# EAGLE design Balancing v1 (EAGLE 9.6.2)
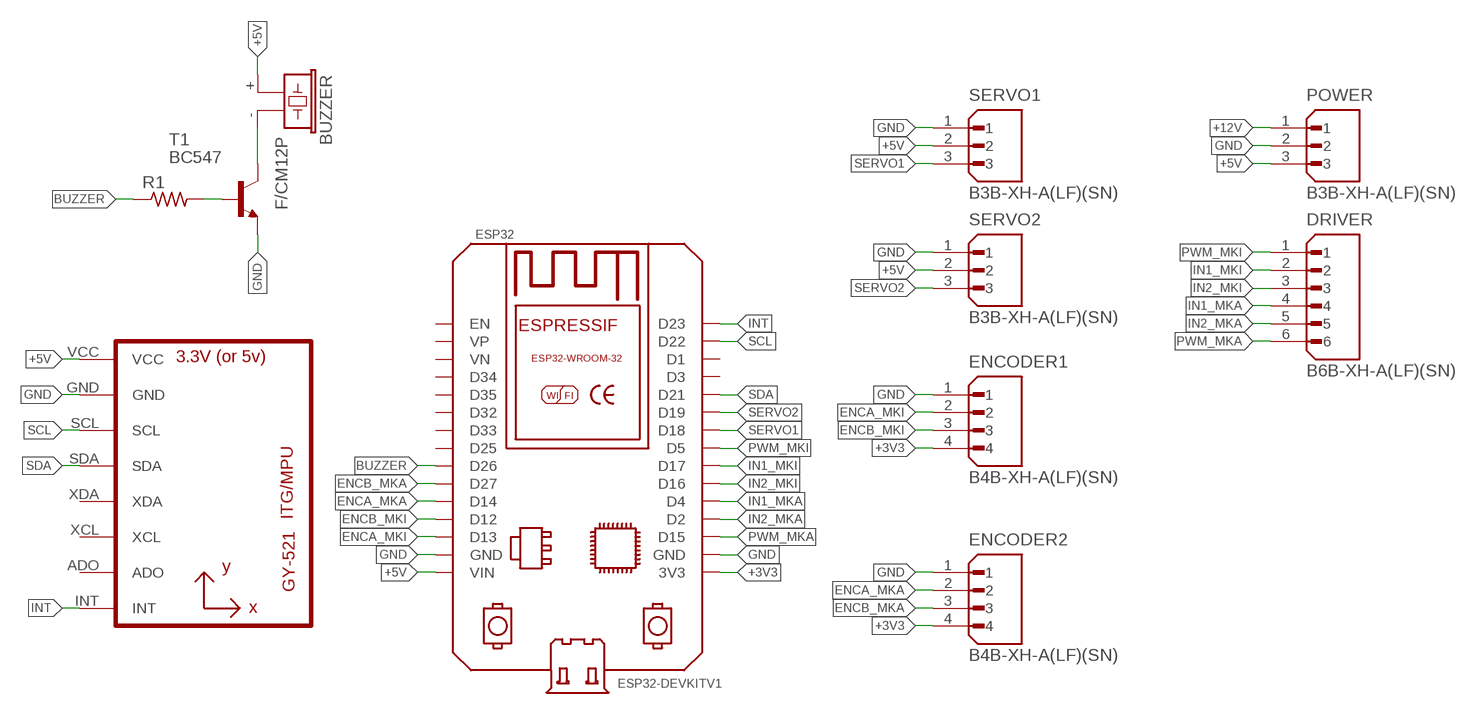
[diagram p0: schematic, sheet 1]

## Parts
BUZZER  F/CM12P  [F/CM12P]
DRIVER  B6B-XH-A(LF)(SN)  [JST_B6B-XH-A(LF)(SN)]
ENCODER1  B4B-XH-A(LF)(SN)  [JST_B4B-XH-A(LF)(SN)]
ENCODER2  B4B-XH-A(LF)(SN)  [JST_B4B-XH-A(LF)(SN)]
ESP32  ESP32DEVKITV1  [ESP32-DEVKITV1]
POWER  B3B-XH-A(LF)(SN)  [JST_B3B-XH-A(LF)(SN)]
R1  R-US_0204/7  [0204/7]
SERVO1  B3B-XH-A(LF)(SN)  [JST_B3B-XH-A(LF)(SN)]
SERVO2  B3B-XH-A(LF)(SN)  [JST_B3B-XH-A(LF)(SN)]
T1  BC547  [TO92]
U1  GY-521MPU6050  [GY-521]

## Nets
+3V3: ENCODER1.4 ENCODER2.4 ESP32.3V3
+5V: BUZZER.+ ESP32.VIN POWER.3 SERVO1.2 SERVO2.2 U1.VCC
+12V: POWER.1
BUZZER: ESP32.D26 R1.1
ENCA_MKA: ENCODER2.2 ESP32.D14
ENCA_MKI: ENCODER1.2 ESP32.D13
ENCB_MKA: ENCODER2.3 ESP32.D27
ENCB_MKI: ENCODER1.3 ESP32.D12
GND: ENCODER1.1 ENCODER2.1 ESP32.GND ESP32.GND@1(GND) POWER.2 SERVO1.1 SERVO2.1 T1.1(E) U1.GND
IN1_MKA: DRIVER.4 ESP32.D4
IN1_MKI: DRIVER.2 ESP32.D17
IN2_MKA: DRIVER.5 ESP32.D2
IN2_MKI: DRIVER.3 ESP32.D16
INT: ESP32.D23 U1.INT
N$1: R1.2 T1.2(B)
N$2: BUZZER.- T1.3(C)
PWM_MKA: DRIVER.6 ESP32.D15
PWM_MKI: DRIVER.1 ESP32.D5
SCL: ESP32.D22 U1.SCL
SDA: ESP32.D21 U1.SDA
SERVO1: ESP32.D18 SERVO1.3
SERVO2: ESP32.D19 SERVO2.3
Unconnected: ESP32.D1 ESP32.D3 ESP32.D25 ESP32.D32 ESP32.D33 ESP32.D34 ESP32.D35 ESP32.EN ESP32.VN ESP32.VP U1.ADO U1.XCL U1.XDA

## Library data of the parts
BUZZER = buzzer:F/CM12P: BUZZER Source: Buerklin; OC_FARNELL: unknown; OC_NEWARK: unknown
DRIVER = JST_6P:B6B-XH-A(LF)(SN): Check availability <https://pricing.snapeda.com/parts/B6B-XH-A%28LF%29%28SN%29/JST%20Sales/view-part?ref=eda>; AVAILABILITY: In Stock; CHECK_PRICES: https://www.snapeda.com/parts/B6B-XH-A(LF)(SN)/JST+Sales+America+Inc./view-part/?ref=eda; DESCRIPTION: Connector Header Through Hole 6 position 0.098 (2.50mm); MF: JST Sales; MP: B6B-XH-A(LF)(SN); PACKAGE: None; PRICE: None; SNAPEDA_LINK: https://www.snapeda.com/parts/B6B-XH-A(LF)(SN)/JST+Sales+America+Inc./view-part/?ref=snap
ENCODER1 ENCODER2 = JST_4P:B4B-XH-A(LF)(SN): Check availability <https://pricing.snapeda.com/parts/B4B-XH-A%20%20%28LF%29%28SN%29/JST/view-part?ref=eda>; AVAILABILITY: In Stock; CHECK_PRICES: https://www.snapeda.com/parts/B4B-XH-A%20%20(LF)(SN)/JST/view-part/?ref=eda; DESCRIPTION: HEADER, VERTICAL, 4WAY; Pitch Spacing: 2.5mm; No. of Contacts: 4Contacts; Gender: Header; Product Range: XH Series; Contact Termination Type: Through Hole; No. of Rows: 1Rows; Contact Plating: Tin Plated Contacts; Contact Material: Brass; SVHC: No SVHC (17-Dec-2015); Contact Resistance: 10mohm; Current Rating: 3A; Insulation Resistance: 1000Mohm; Operating Temperature Max: 85°C; Operating Temperature Min: -25°C; Voltage Rating VAC: 250V; Wire Size AWG Max: 22AWG; Wire Size AWG Min: 30AWG; Withstand Voltage: 1000V; MF: JST; MP: B4B-XH-A (LF)(SN); PACKAGE: None; PRICE: None; SNAPEDA_LINK: https://www.snapeda.com/parts/B4B-XH-A%20%20(LF)(SN)/JST/view-part/?ref=snap
ESP32 = ESP32-DEVKITV1:ESP32DEVKITV1: https://github.com/shridattdudhat
POWER SERVO1 SERVO2 = JST_3P:B3B-XH-A(LF)(SN): Check availability <https://pricing.snapeda.com/parts/B3B-XH-A%20%28LF%29%28SN%29/JST%20Sales%20America%20Inc./view-part?ref=eda>; AVAILABILITY: In Stock; CHECK_PRICES: https://www.snapeda.com/parts/B3B-XH-A%20(LF)(SN)/JST+Sales+America+Inc./view-part/?ref=eda; DESCRIPTION: Connector Header Through Hole 3 position 0.098 (2.50mm); MF: JST Sales America Inc.; MP: B3B-XH-A (LF)(SN); PACKAGE: None; PRICE: None; SNAPEDA_LINK: https://www.snapeda.com/parts/B3B-XH-A%20(LF)(SN)/JST+Sales+America+Inc./view-part/?ref=snap
R1 = rcl:R-US_: RESISTOR, American symbol; SPICEPREFIX: R
T1 = transistor:BC547: NPN TRANSISTOR
U1 = gy-521:GY-521

## Board
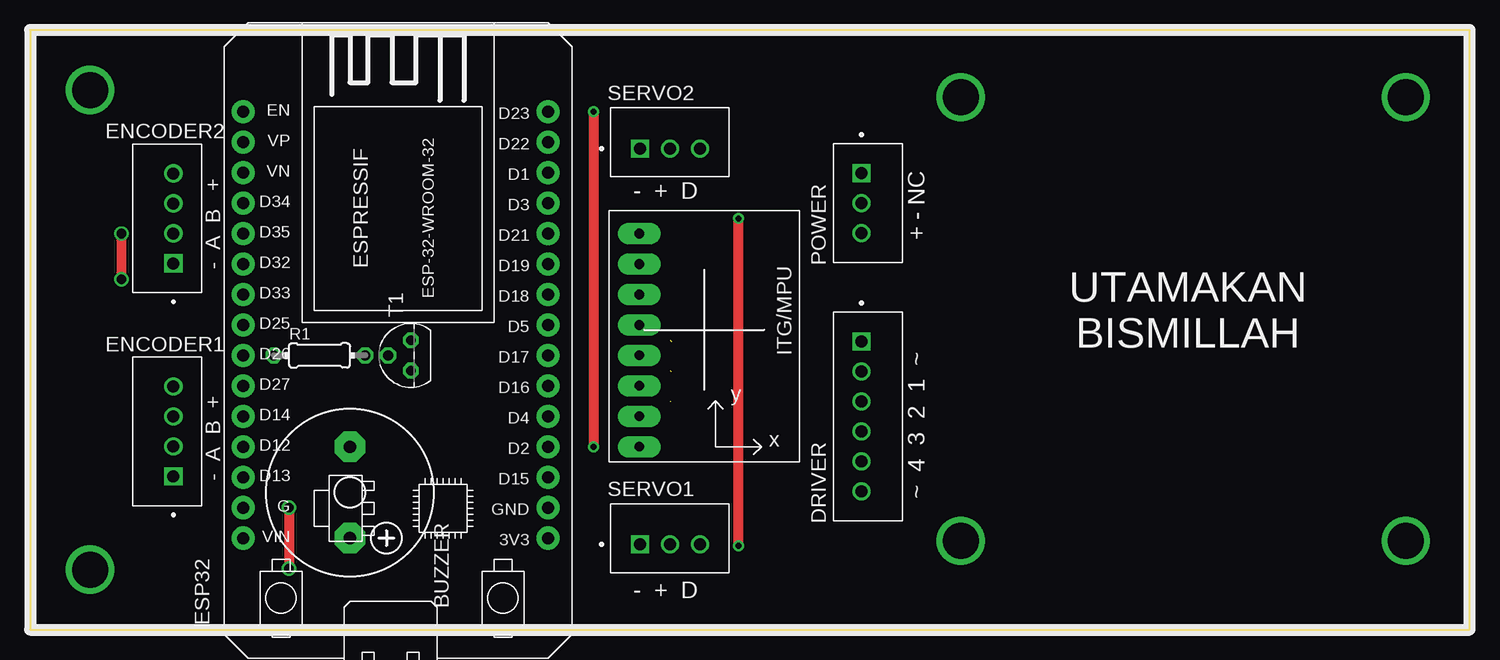
[diagram p1: board, top side]
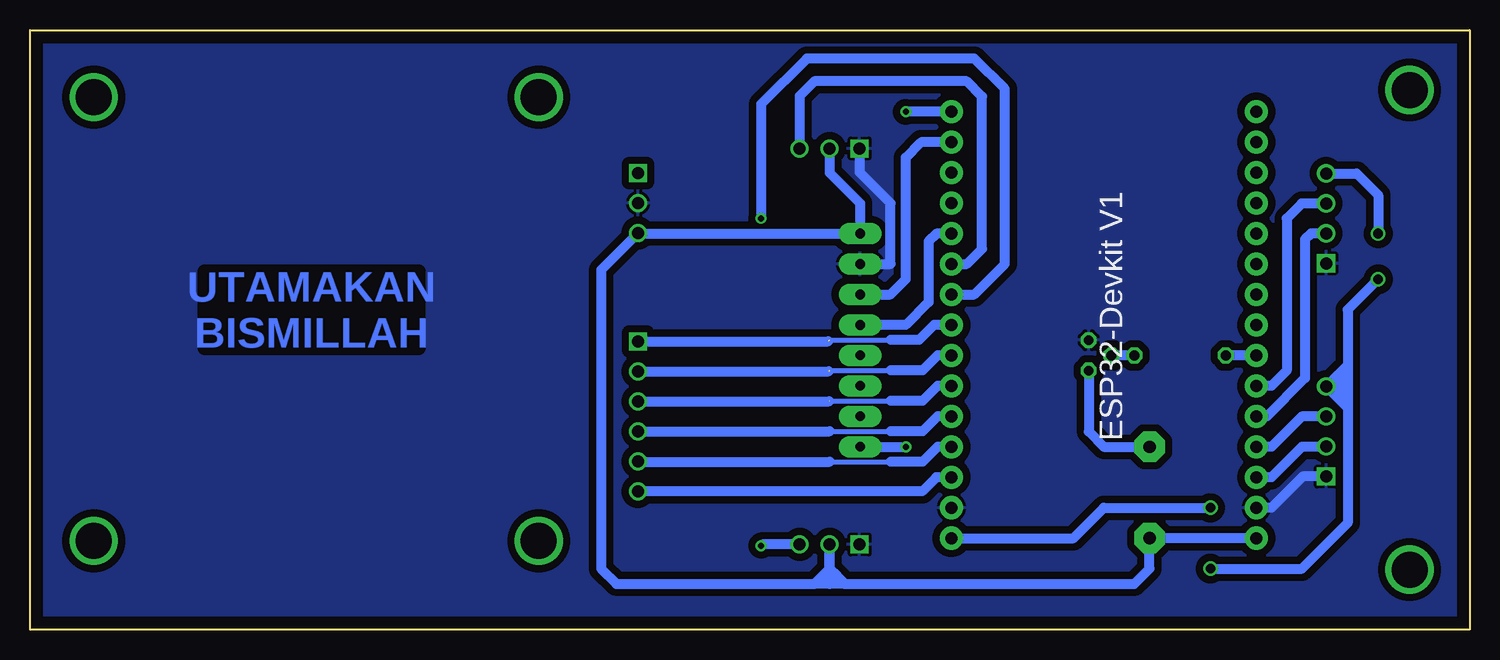
[diagram p2: board, bottom side, seen from below]

Size 120 x 50 mm. Coordinates in mm from the lower left corner, seen from the top.
Outline: 0,50 0,0 120,0 120,50 0,50
Copper layers (1*16): Top 0.035mm / dielectric 1.5mm / Bottom 0.035mm
Design rules "default": minimum track width 6mil, minimum drill 0.35mm, track to track 6mil, track to pad 6mil, pad to pad 6mil, via to via 6mil, smd to smd 6mil, copper to edge 40mil, drill to drill 6mil, minimum pad ring 10mil, minimum via ring 8mil, stop-mask expansion 4mil, vias tented up to drill 0mil, thermal gap 10mil

### Footprints (pad centres in the part's own frame; a part is rotated, then mirrored left to right if it is on the bottom)
F/CM12P = drill 1.016 pad 2.54 octagon: + 3.81,0; - -3.81,0
JST_B6B-XH-A(LF)(SN) = drill 1 square: 1 -6.25,-0.525 | drill 1: 2 -3.75,-0.525; 3 -1.25,-0.525; 4 1.25,-0.525; 5 3.75,-0.525; 6 6.25,-0.525
JST_B4B-XH-A(LF)(SN) = drill 1 square: 1 -3.75,-0.525 | drill 1: 2 -1.25,-0.525; 3 1.25,-0.525; 4 3.75,-0.525
ESP32-DEVKITV1 = drill 1 pad 1.93: 3V3 0,0; D1 30.48,0; D2 7.62,0; D3 27.94,0; D4 10.16,0; D5 17.78,0; D12 7.62,25.4; D13 5.08,25.4; D14 10.16,25.4; D15 5.08,0; D16 12.7,0; D17 15.24,0; D18 20.32,0; D19 22.86,0; D21 25.4,0; D22 33.02,0; D23 35.56,0; D25 17.78,25.4; D26 15.24,25.4; D27 12.7,25.4; D32 22.86,25.4; D33 20.32,25.4; D34 27.94,25.4; D35 25.4,25.4; EN 35.56,25.4; GND 2.54,25.4; GND@1 2.54,0; VIN 0,25.4; VN 30.48,25.4; VP 33.02,25.4
JST_B3B-XH-A(LF)(SN) = drill 1 square: 1 -2.5,-0.525 | drill 1: 2 0,-0.525; 3 2.5,-0.525
0204/7 = drill 0.813 octagon: 1 -3.81,0; 2 3.81,0
TO92 = drill 0.813 octagon: 1 1.27,0; 2 0,1.905; 3 -1.27,0
GY-521 = drill 0.8 pad 1.778 long: ADO -8.89,-6.35; GND -8.89,6.35; INT -8.89,-8.89; SCL -8.89,3.81; SDA -8.89,1.27; VCC -8.89,8.89; XCL -8.89,-3.81; XDA -8.89,-1.27

### Placement (x,y rotation side)
BUZZER  26.67,11.43 270 top
DRIVER  69.85,17.78 270 top
ENCODER1  11.43,16.51 90 top
ENCODER2  11.43,34.29 90 top
ESP32  43.18,7.62 90 top
POWER  69.85,35.56 270 top
R1  24.13,22.86 0 top
SERVO1  53.34,7.62 0 top
SERVO2  53.34,40.64 0 top
T1  31.75,22.86 90 top
U1  59.69,24.13 0 top

### Tracks (layer width: path | path; a pad name or v marks a point on that pad's centre or on a via)
+3V3  (via drill 0.8)
  Top 0.813: v21.59,10.16 v21.59,5.08 | v7.62,33.02 v7.62,29.21
  Bottom 0.813: ENCODER2.4 9.41,38.04 7.62,36.24 v7.62,33.02 | ESP32.3V3 33.02,7.62 30.48,10.16 v21.59,10.16 | v21.59,5.08 13.97,5.08 10.16,8.89 10.16,18.46 | ENCODER1.4 10.16,18.46 | 10.16,22.05 10.16,26.67 v7.62,29.21 | 10.16,22.05 10.16,21.59 | 10.16,21.59 10.16,20.32 | 10.16,20.32 10.16,19.05 | 10.16,19.05 10.16,18.46 | ENCODER1.4 10.16,22.05 | ENCODER1.4 11.49,20.26 10.16,21.59 | ENCODER1.4 11.37,20.26 10.16,19.05 | ENCODER1.4 10.22,20.26 10.16,20.32
+5V
  Bottom 0.813: SERVO2.2 53.34,38.1 50.8,35.56 U1.VCC 69.28,33.02 POWER.3 72.39,30 72.39,5.08 71.12,3.81 54.61,3.81 | 53.34,5.08 SERVO1.2 53.34,4.55 | 53.34,5.08 52.7,4.45 | 52.7,4.45 52.07,3.81 | 52.07,3.81 27.94,3.81 26.67,5.08 BUZZER.+ ESP32.VIN | 53.34,5.08 53.98,4.45 | 53.34,3.81 54.61,3.81 | 52.07,3.81 53.34,3.81 | 53.34,3.81 53.98,4.45 | 54.61,3.81 53.98,4.45 | 53.98,4.45 52.7,4.45
BUZZER
  Bottom 0.813: ESP32.D26 R1.1
ENCA_MKA
  Bottom 0.813: ESP32.D14 16.89,17.78 13.72,20.96 13.72,32.55 13.22,33.04 ENCODER2.2
ENCA_MKI
  Bottom 0.813: ENCODER1.2 11.97,15.24 13.97,15.24 16.51,12.7 ESP32.D13
ENCB_MKA
  Bottom 0.813: ESP32.D27 16.51,20.32 15.24,21.59 15.24,34.29 13.99,35.54 ENCODER2.3
ENCB_MKI
  Bottom 0.813: ENCODER1.3 13.99,17.76 16.51,15.24 ESP32.D12
GND
  Bottom 0.813: ESP32.GND 16.51,10.16 13.91,12.76 ENCODER1.1 11.89,12.7 | SERVO2.1 50.84,38.14 48.26,35.56 48.26,30.48 U1.GND
  pour Bottom (isolate 0.61): 0,0 120,0 120,50 0,50
IN1_MKA
  Bottom 0.406: 53.34,16.54 48.26,16.54
  Bottom 0.813: ESP32.D4 44.34,17.78 45.59,16.54 48.26,16.54 | DRIVER.4 53.34,16.53 53.34,16.54
IN1_MKI  (1 unrouted)
  Bottom 0.406: 53.34,21.61 48.26,21.61
  Bottom 0.813: ESP32.D17 44.34,22.86 45.59,21.61 48.26,21.61 | DRIVER.2 53.42,21.53
IN2_MKA
  Bottom 0.406: 53.34,13.99 48.26,13.99
  Bottom 0.813: ESP32.D2 44.34,15.24 45.59,13.99 48.26,13.99 | DRIVER.5 69.29,13.99 53.34,13.99
IN2_MKI  (1 unrouted)
  Bottom 0.406: 53.34,19.07 48.26,19.07
  Bottom 0.813: ESP32.D16 44.34,20.32 45.59,19.07 48.26,19.07 | DRIVER.3 53.38,19.03
INT  (via drill 0.5)
  Top 0.813: v46.99,43.18 v46.99,15.24
  Bottom 0.813: ESP32.D23 v46.99,43.18 | U1.INT v46.99,15.24
N$1
  Bottom 0.813: R1.2 T1.2
N$2
  Bottom 0.813: T1.3 31.75,16.51 30.48,15.24 BUZZER.-
N$3  (via drill 3)
  other vias: 5,45
N$4  (via drill 3)
  other vias: 5,5
N$5  (via drill 3)
  other vias: 114.7,44.4
N$6  (via drill 3)
  other vias: 114.7,7.4
N$7  (via drill 3)
  other vias: 77.59,7.4
N$8  (via drill 3)
  other vias: 77.59,44.4
PWM_MKA
  Bottom 0.813: ESP32.D15 44.45,12.7 45.62,11.53 DRIVER.6
PWM_MKI  (1 unrouted)
  Bottom 0.406: 53.34,24.16 48.26,24.16
  Bottom 0.813: ESP32.D5 44.64,25.4 45.89,24.16 48.26,24.16 | DRIVER.1 53.47,24.03
SCL
  Bottom 0.813: U1.SCL 48.26,27.94 46.99,29.21 46.99,39.37 45.72,40.64 ESP32.D22
SDA
  Bottom 0.813: ESP32.D21 44.45,33.02 45.09,32.38 45.09,27.3 46.99,25.4 U1.SDA
SERVO1  (via drill 0.5)
  Top 0.813: v59.05,6.99 v59.05,34.29
  Bottom 0.813: ESP32.D18 41.27,27.94 38.73,30.48 38.73,45.09 41.27,47.62 55.24,47.62 59.05,43.81 v59.05,34.29 | SERVO1.3 58.95,7.09 v59.05,6.99
SERVO2
  Bottom 0.813: ESP32.D19 41.91,30.48 40.64,31.75 40.64,44.45 41.91,45.72 54.61,45.72 55.84,44.49 SERVO2.3

### Text on the board
Bottom: UTAMAKAN / BISMILLAH
tPlace: - + D | + - NC | - A B + | UTAMAKAN / BISMILLAH | - A B + | ~ 4 3 2 1 ~ | - + D